# Altium project PCB_Project1.PrjPCB
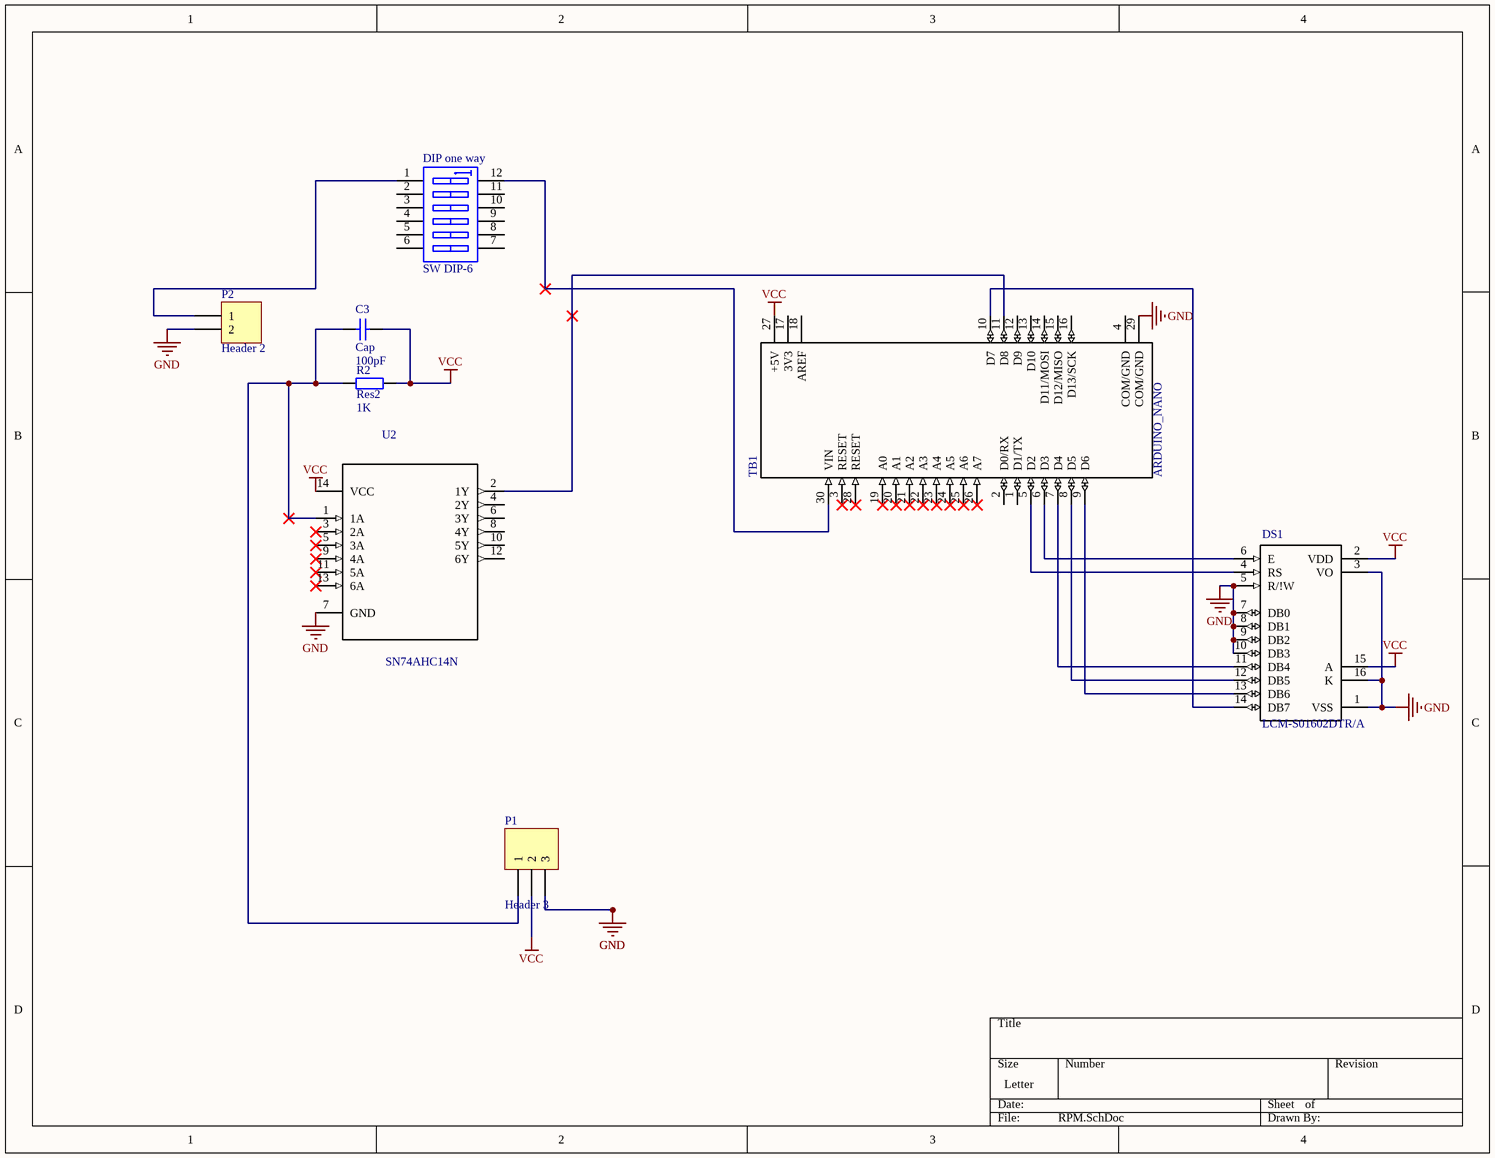
[diagram p0: RPM.SchDoc]
1 sheet, 8 parts. Net scope: global (net labels, ports and power ports of the same name join across sheets).
Board file: PCB1.PcbDoc

## Sheet RPM.SchDoc
size Letter

### Parts
C3  Cap  value 100pF  [RAD-0.3]
DIP_one_way  SW DIP-6  [DIP-12/SW]
DS1  LCM-S01602DTR/A  [LCD_LCM-S01602DTR/A]
P1  Header 3  [HDR1X3]
P2  Header 2  [HDR1X2]
R2  Res2  value 1K  [AXIAL-0.4]
TB1  ARDUINO_NANO  [*SHIELD_ARDUINO_NANO]
U2  SN74AHC14N  [DIP254P762X508-14]

### Nets
GND: DS1.1(VSS) DS1.3(VO) DS1.5(R/!W) DS1.7(DB0) DS1.8(DB1) DS1.9(DB2) DS1.10(DB3) DS1.16(K) P1.3 P2.2 TB1.29(COM/GND) U2.7(GND)
VCC: C3.2 DS1.2(VDD) DS1.15(A) P1.2 R2.2 TB1.27(+5V) U2.14(VCC)
NetC3_1: C3.1 P1.1 R2.1 U2.1(1A)
NetDIP_one_way_1: DIP_one_way.1(A1) P2.1
NetDIP_one_way_12: DIP_one_way.12(B1) TB1.30(VIN)
NetDS1_4: DS1.4(RS) TB1.5(D2)
NetDS1_6: DS1.6(E) TB1.6(D3)
NetDS1_11: DS1.11(DB4) TB1.7(D4)
NetDS1_12: DS1.12(DB5) TB1.8(D5)
NetDS1_13: DS1.13(DB6) TB1.9(D6)
NetDS1_14: DS1.14(DB7) TB1.10(D7)
NetTB1_11: TB1.11(D8) U2.2(1Y)

Not connected (* = marked no-connect by the designer): DIP_one_way 2(A2) 3(A3) 4(A4) 5(A5) 6(A6) 7(B6) 8(B5) 9(B4) 10(B3) 11(B2); TB1 1(D1/TX) 2(D0/RX) 3(RESET)* 4(COM/GND) 12(D9) 13(D10) 14(D11/MOSI) 15(D12/MISO) 16(D13/SCK) 17(3V3) 18(AREF) 19(A0)* 20(A1)* 21(A2)* 22(A3)* 23(A4)* 24(A5)* 25(A6)* 26(A7)* 28(RESET)*; U2 3(2A)* 4(2Y) 5(3A)* 6(3Y) 8(4Y) 9(4A)* 10(5Y) 11(5A)* 12(6Y) 13(6A)*

### Library data of the parts
C3 = Cap: Capacitor; Published: 8-Jun-2000; LatestRevisionDate: 17-Jul-2002; LatestRevisionNote: Re-released for DXP Platform.; PackageReference: RAD-0.3; Publisher: Altium Limited; PackageDescription: Radial Cap, Thru-Hole; 2 Leads; 0.3 in Pin Spacing
DIP_one_way = SW DIP-6: DIP Switch, 6 Position, SPST; Published: 24-Mar-1999; LatestRevisionDate: 17-Jul-2002; LatestRevisionNote: Re-released for DXP Platform.; PackageReference: DIP-12/SW; Publisher: Altium Limited; PackageDescription: DIP Switch; 12 Leads
DS1 = LCM-S01602DTR/A: Module, LCD; 16 x 2 mm; 5 x 8; 5 V _Typ._; 2 mA _Typ._; 4.2 V @50 degC _Min._; MF: Lumex; SnapEDA_Link: https://www.snapeda.com/parts/LCM-S01602DTR/A/Lumex%2520Opto/Components%2520Inc/view-part/?ref=snap; Availability: Warning; MP: LCM-S01602DTR/A; Price: 8.26 USD; Package: None; Value: *
P1 = Header 3: Header, 3-Pin; LatestRevisionDate: 17-Jul-2002; LatestRevisionNote: Re-released for DXP Platform.; Publisher: Altium Limited
P2 = Header 2: Header, 2-Pin; LatestRevisionDate: 17-Jul-2002; LatestRevisionNote: Re-released for DXP Platform.; Publisher: Altium Limited
R2 = Res2: Resistor; Published: 8-Jun-2000; LatestRevisionDate: 17-Jul-2002; LatestRevisionNote: Re-released for DXP Platform.; PackageReference: AXIAL-0.4; Publisher: Altium Limited; PackageDescription: Axial Device, Thru-Hole; 2 Leads; 0.4 in Pin Spacing
TB1 = ARDUINO_NANO: Dev.kit: Arduino; UART; ICSP, USB B mini, pin strips; MP: ARDUINO NANO; MF: Arduino; Price: None; Package: None; Availability: Unavailable; SnapEDA_Link: https://www.snapeda.com/parts/ARDUINO%20NANO/Arduino/view-part/?ref=snap; Value: *
U2 = SN74AHC14N: Inverter Schmitt Trigger 6-Element CMOS 14-Pin PDIP Tube; MF: Texas Instruments; MP: SN74AHC14N; Package: DIP-14 Texas Instruments; Price: None; Availability: Unavailable; SnapEDA_Link: https://www.snapeda.com/parts/SN74AHC14N/Texas%20Instruments/view-part/?ref=snap; Value: *